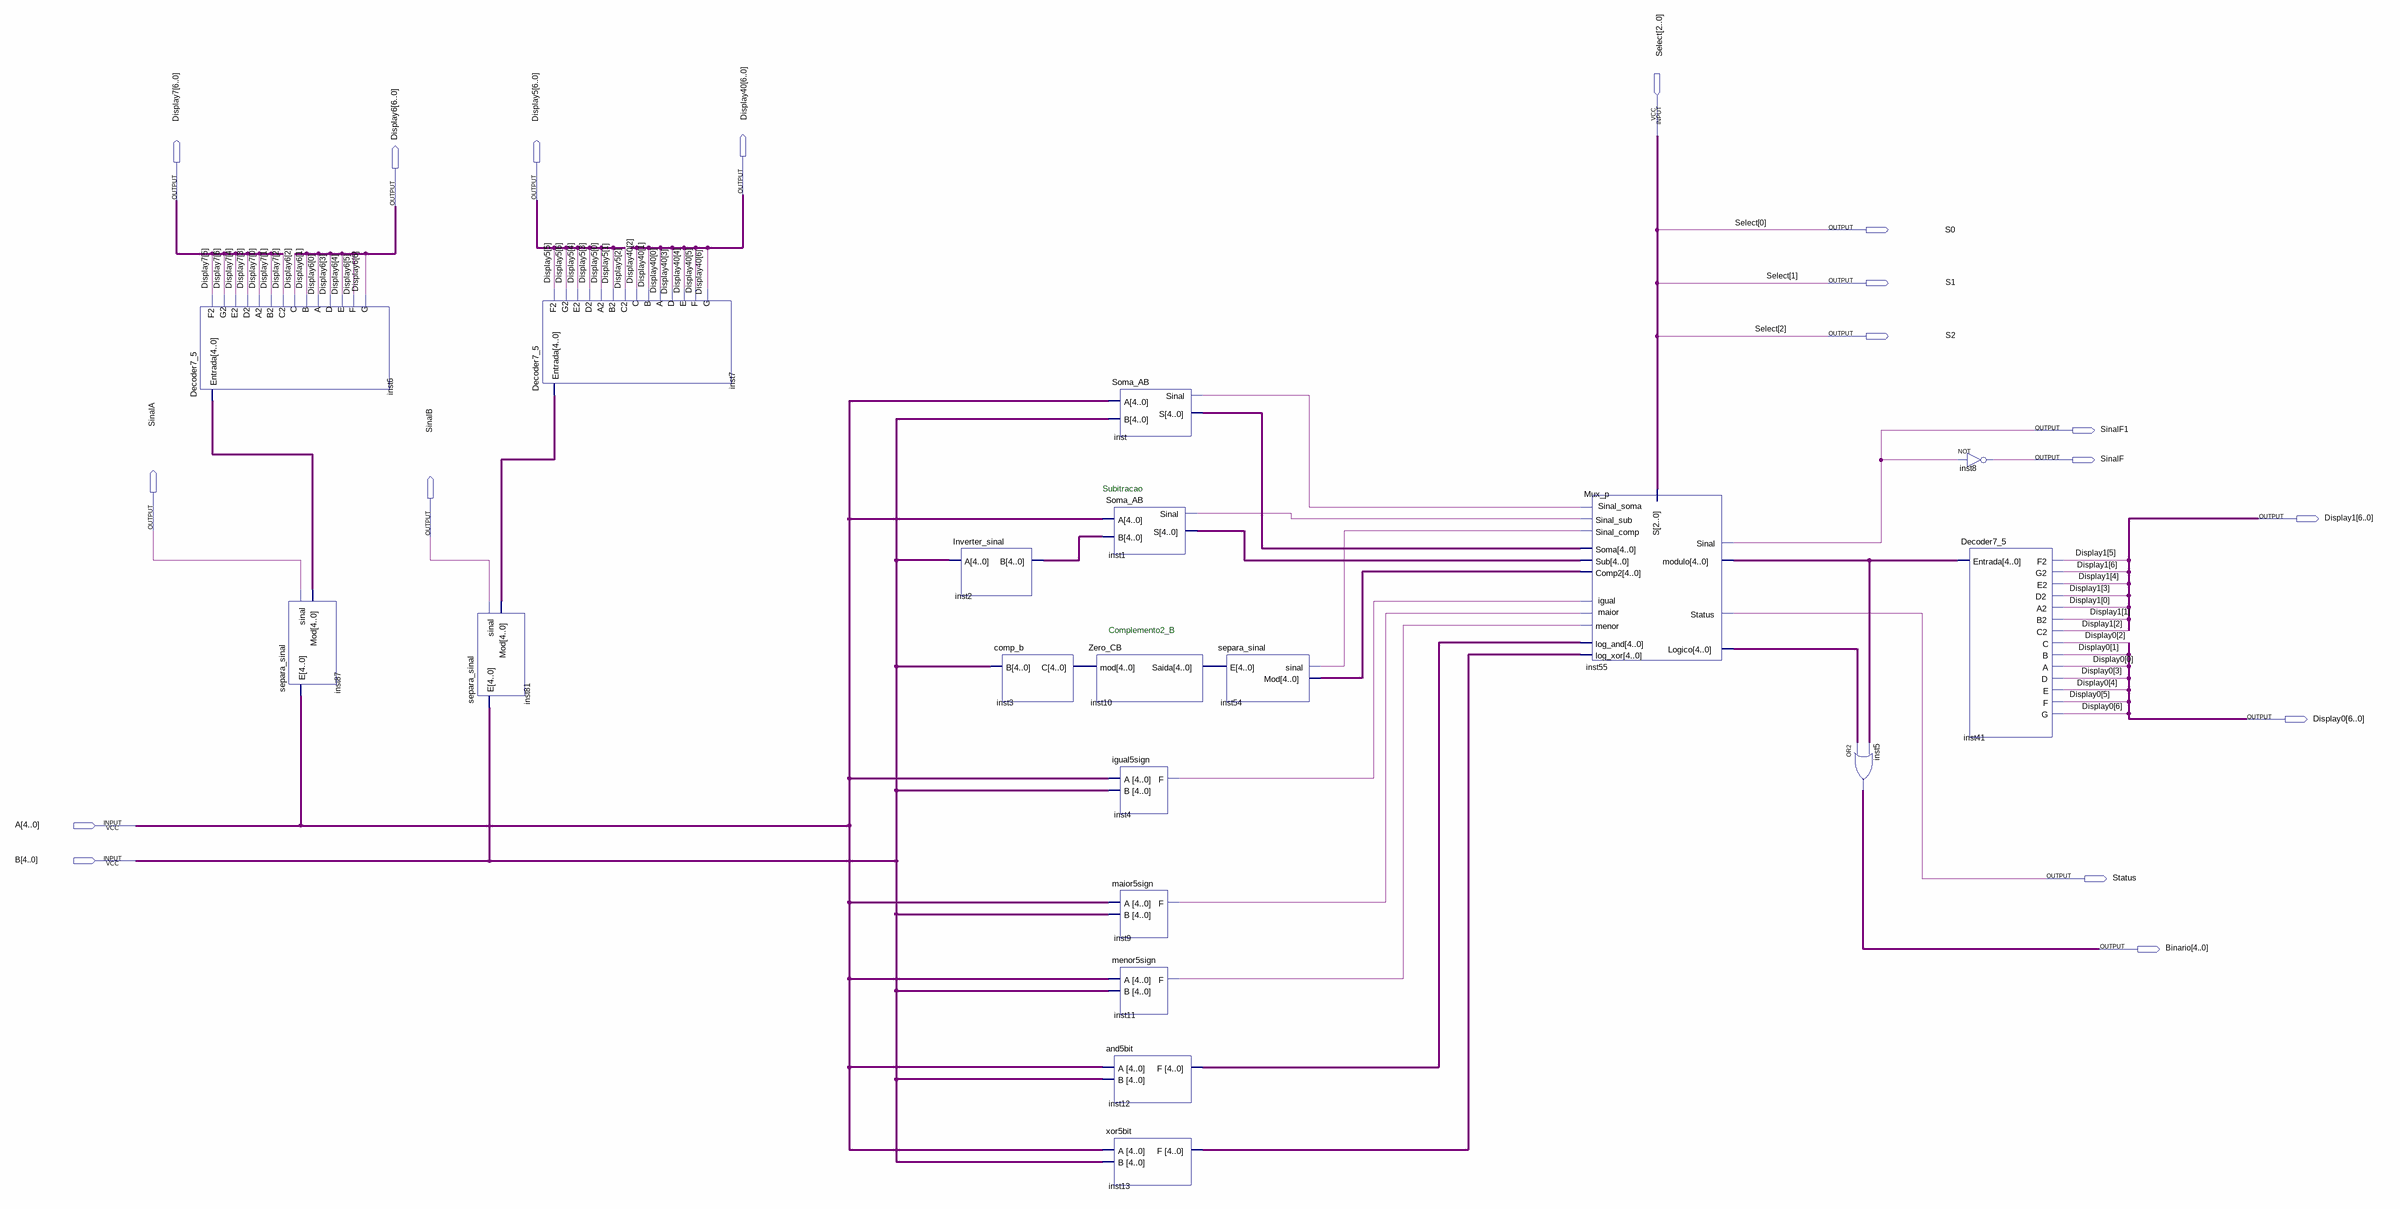
[diagram p0: schematic sheet]
// Quartus schematic Projeto_ULA.bdf as structural Verilog: 19 symbols, 18 pins
module Projeto_ULA (
  input  [2:0] Select,
  input  [4:0] A,
  input  [4:0] B,
  output [6:0] Display40,
  output [6:0] Display7,
  output [6:0] Display5,
  output [6:0] Display6,
  output S0,
  output S1,
  output S2,
  output SinalF1,
  output SinalF,
  output [6:0] Display1,
  output SinalA,
  output SinalB,
  output [6:0] Display0,
  output Status,
  output [4:0] Binario
);

  wire inst1_sinal, inst4_f, inst9_f, inst11_f, inst54_sinal, inst_sinal;
  wire [4:0] inst1_s, inst2_b, inst3_c, inst10_saida, inst12_f, inst13_f, inst54_mod, inst55_logico,
       inst55_modulo, inst81_mod, inst87_mod, inst_s;

  Decoder7_5 inst6 (
    .Entrada(inst87_mod), .F2(Display7[5]), .G2(Display7[6]), .E2(Display7[4]), .D2(Display7[3]),
    .A2(Display7[0]), .B2(Display7[1]), .C2(Display7[2]), .C(Display6[2]), .B(Display6[1]), .A(Display6[0]),
    .D(Display6[3]), .E(Display6[4]), .F(Display6[5]), .G(Display6[6]));
  separa_sinal inst87 (.E(A), .sinal(SinalA), .Mod(inst87_mod));
  separa_sinal inst81 (.E(B), .sinal(SinalB), .Mod(inst81_mod));
  Decoder7_5 inst7 (
    .Entrada(inst81_mod), .F2(Display5[5]), .G2(Display5[6]), .E2(Display5[4]), .D2(Display5[3]),
    .A2(Display5[0]), .B2(Display5[1]), .C2(Display5[2]), .C(Display40[2]), .B(Display40[1]),
    .A(Display40[0]), .D(Display40[3]), .E(Display40[4]), .F(Display40[5]), .G(Display40[6]));
  Inverter_sinal inst2 (.A(B), .B(inst2_b));
  comp_b inst3 (.B(B), .C(inst3_c));
  Zero_CB inst10 (.mod(inst3_c), .Saida(inst10_saida));
  Soma_AB inst (.A(A), .B(B), .Sinal(inst_sinal), .S(inst_s));
  Soma_AB inst1 (.A(A), .B(inst2_b), .Sinal(inst1_sinal), .S(inst1_s));
  igual5sign inst4 (.A(A), .B(B), .F(inst4_f));
  maior5sign inst9 (.A(A), .B(B), .F(inst9_f));
  menor5sign inst11 (.A(A), .B(B), .F(inst11_f));
  and5bit inst12 (.A(A), .B(B), .F(inst12_f));
  xor5bit inst13 (.A(A), .B(B), .F(inst13_f));
  separa_sinal inst54 (.E(inst10_saida), .sinal(inst54_sinal), .Mod(inst54_mod));
  Mux_p inst55 (
    .Sinal_comp(inst54_sinal), .Sinal_sub(inst1_sinal), .Sinal_soma(inst_sinal), .Soma(inst_s),
    .Sub(inst1_s), .Comp2(inst54_mod), .igual(inst4_f), .maior(inst9_f), .menor(inst11_f),
    .log_and(inst12_f), .log_xor(inst13_f), .S(Select), .Sinal(SinalF1), .modulo(inst55_modulo),
    .Status(Status), .Logico(inst55_logico));
  assign Binario = inst55_logico | inst55_modulo;  // OR2 inst5, 5 bits wide
  not inst8 (SinalF, SinalF1);
  Decoder7_5 inst41 (
    .Entrada(inst55_modulo), .F2(Display1[5]), .G2(Display1[6]), .E2(Display1[4]), .D2(Display1[3]),
    .A2(Display1[0]), .B2(Display1[1]), .C2(Display1[2]), .C(Display0[2]), .B(Display0[1]), .A(Display0[0]),
    .D(Display0[3]), .E(Display0[4]), .F(Display0[5]), .G(Display0[6]));

  assign S0 = Select[0];
  assign S1 = Select[1];
  assign S2 = Select[2];

  // Notes on the sheet:
  //   Subitracao
  //   Complemento2_B
endmodule
